# EAGLE design breakboard (EAGLE 7.2.0)
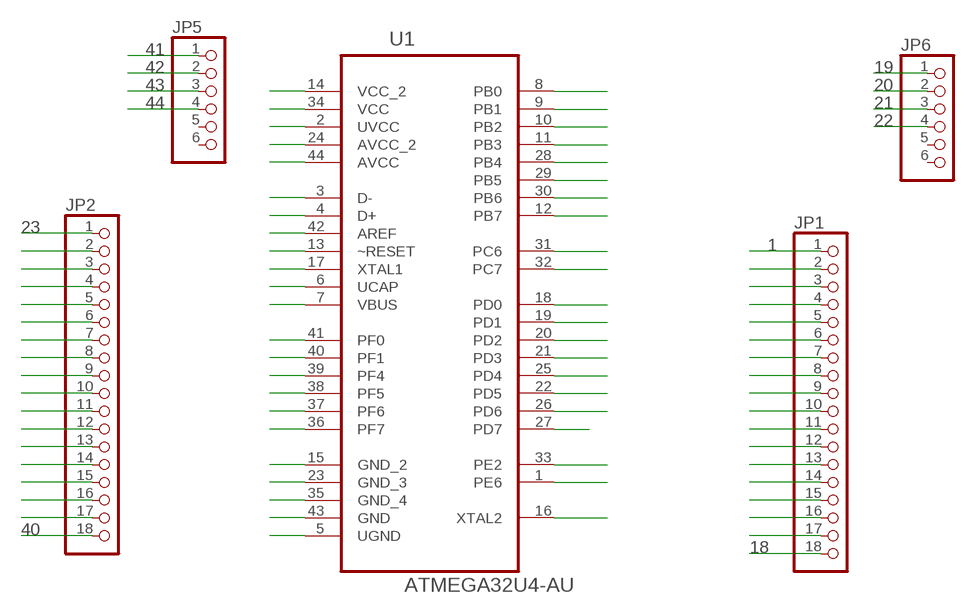
[diagram p0: schematic, sheet 1]

## Parts
JP1  PINHD-1X18-BIG  [1X18-BIG]
JP2  PINHD-1X18-BIG  [1X18-BIG]
JP5  PINHD-1X6  [1X06]
JP6  PINHD-1X6  [1X06]
U1  ATMEGA32U4-AU  [QFP80P1200X1200X120-44N]

## Nets
1: JP1.1 U1.1(PE6)
2: JP1.2 U1.2(UVCC)
3: JP1.3 U1.3(D-)
4: JP1.4 U1.4(D+)
5: JP1.5 U1.5(UGND)
6: JP1.6 U1.6(UCAP)
7: JP1.7 U1.7(VBUS)
8: JP1.8 U1.8(PB0)
9: JP1.9 U1.9(PB1)
10: JP1.10 U1.10(PB2)
11: JP1.11 U1.11(PB3)
12: JP1.12 U1.12(PB7)
13: JP1.13 U1.13(~RESET)
14: JP1.14 U1.14(VCC_2)
15: JP1.15 U1.15(GND_2)
16: JP1.16 U1.16(XTAL2)
17: JP1.17 U1.17(XTAL1)
18: JP1.18 U1.18(PD0)
19: JP6.1 U1.19(PD1)
20: JP6.2 U1.20(PD2)
21: JP6.3 U1.21(PD3)
22: JP6.4 U1.22(PD5)
23: JP2.1 U1.23(GND_3)
24: JP2.2 U1.24(AVCC_2)
25: JP2.3 U1.25(PD4)
26: JP2.4 U1.26(PD6)
27: JP2.5 U1.27(PD7)
28: JP2.6 U1.28(PB4)
29: JP2.7 U1.29(PB5)
30: JP2.8 U1.30(PB6)
31: JP2.9 U1.31(PC6)
32: JP2.10 U1.32(PC7)
33: JP2.11 U1.33(PE2)
34: JP2.12 U1.34(VCC)
35: JP2.13 U1.35(GND_4)
36: JP2.14 U1.36(PF7)
37: JP2.15 U1.37(PF6)
38: JP2.16 U1.38(PF5)
39: JP2.17 U1.39(PF4)
40: JP2.18 U1.40(PF1)
41: JP5.1 U1.41(PF0)
42: JP5.2 U1.42(AREF)
43: JP5.3 U1.43(GND)
44: JP5.4 U1.44(AVCC)
Unconnected: JP5.5 JP5.6 JP6.5 JP6.6

## Library data of the parts
JP1 JP2 = adafruit:PINHD-1X18: PIN HEADER
JP5 JP6 = adafruit:PINHD-1X6: PIN HEADER
U1 = Atmel_By_element14_Batch_1-00:ATMEGA32U4-AU: 8-bit Microcontroller with ISP Flash and USB Controller; MPN: ATMEGA32U4-AU; OC_FARNELL: 1748525; OC_NEWARK: 26R5633; PACKAGE: TQFP-44; SUPPLIER: Atmel

## Board
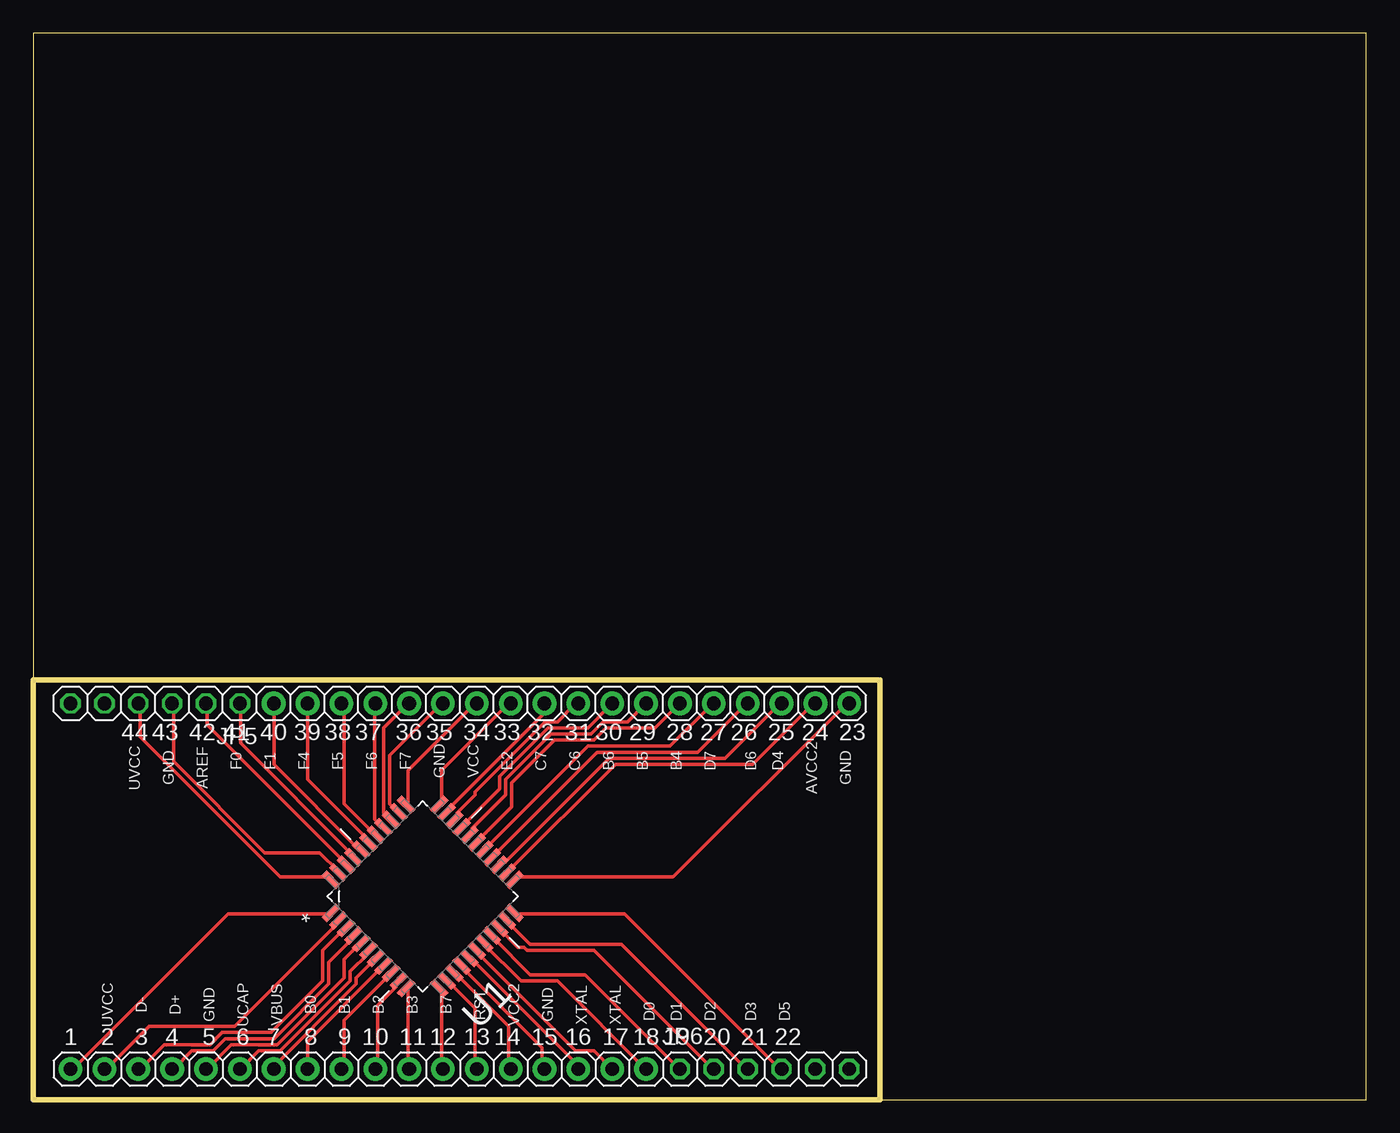
[diagram p1: board, top side]

Size 100 x 80 mm. Coordinates in mm from the lower left corner, seen from the top.
Outline: 63.5,0 100,0 100,80 0,80 0,31.5
Outline: 0,31.5 63.5,31.5 63.5,0
Outline: 63.5,0 0,0 0,31.5
Copper layers (1*16): Top 0.035mm / dielectric 1.5mm / Bottom 0.035mm
Design rules "default": minimum track width 10mil, minimum drill 24mil, track to track 8mil, track to pad 8mil, pad to pad 8mil, via to via 8mil, smd to smd 8mil, copper to edge 40mil, drill to drill 8mil, minimum pad ring 10mil, minimum via ring 8mil, stop-mask expansion 4mil, vias tented up to drill 0mil, thermal gap 10mil

### Footprints (pad centres in the part's own frame; a part is rotated, then mirrored left to right if it is on the bottom)
1X18-BIG = drill 1.016 pad 1.778: 1 -21.59,0; 2 -19.05,0; 3 -16.51,0; 4 -13.97,0; 5 -11.43,0; 6 -8.89,0; 7 -6.35,0; 8 -3.81,0; 9 -1.27,0; 10 1.27,0; 11 3.81,0; 12 6.35,0; 13 8.89,0; 14 11.43,0; 15 13.97,0; 16 16.51,0; 17 19.05,0; 18 21.59,0
1X06 = drill 1.016 octagon: 1 -6.35,0; 2 -3.81,0; 3 -1.27,0; 4 1.27,0; 5 3.81,0; 6 6.35,0
QFP80P1200X1200X120-44N = smd 1.473 x 0.508: 1 -5.74,3.988; 2 -5.74,3.2; 3 -5.74,2.388; 4 -5.74,1.6; 5 -5.74,0.787; 6 -5.74,0; 7 -5.74,-0.787; 8 -5.74,-1.6; 9 -5.74,-2.388; 10 -5.74,-3.2; 11 -5.74,-3.988; 23 5.74,-3.988; 24 5.74,-3.2; 25 5.74,-2.388; 26 5.74,-1.6; 27 5.74,-0.787; 28 5.74,0; 29 5.74,0.787; 30 5.74,1.6; 31 5.74,2.388; 32 5.74,3.2; 33 5.74,3.988 | smd 0.508 x 1.473: 12 -3.988,-5.74; 13 -3.2,-5.74; 14 -2.388,-5.74; 15 -1.6,-5.74; 16 -0.787,-5.74; 17 0,-5.74; 18 0.787,-5.74; 19 1.6,-5.74; 20 2.388,-5.74; 21 3.2,-5.74; 22 3.988,-5.74; 34 3.988,5.74; 35 3.2,5.74; 36 2.388,5.74; 37 1.6,5.74; 38 0.787,5.74; 39 0,5.74; 40 -0.787,5.74; 41 -1.6,5.74; 42 -2.388,5.74; 43 -3.2,5.74; 44 -3.988,5.74

### Placement (x,y rotation side)
JP1  24.38,2.29 0 top
JP2  39.62,29.72 180 top
JP5  9.14,29.72 180 top
JP6  54.86,2.29 0 top
U1  29.21,15.24 45 top

### Tracks (layer width: path | path; a pad name or v marks a point on that pad's centre or on a via)
1
  Top 0.254: U1.1 22.17,13.95 14.63,13.95 2.97,2.29 JP1.1
2
  Top 0.254: U1.2 22.86,13.26 15.09,5.49 8.69,5.49 5.49,2.29 JP1.2
3
  Top 0.254: U1.3 23.32,12.8 21.72,11.2 21.72,8.91 17.83,5.03 14.17,5.03 13.26,4.12 9.83,4.12 8,2.29 JP1.3
4
  Top 0.254: U1.4 24,12.12 22.17,10.29 22.17,8.69 18.06,4.57 14.4,4.57 13.49,3.66 11.89,3.66 10.52,2.29 JP1.4
5
  Top 0.254: U1.5 24.46,11.66 23.32,10.52 23.32,9.14 18.29,4.12 14.86,4.12 13.03,2.29 JP1.5
6
  Top 0.254: U1.6 25.15,10.97 23.77,9.6 23.77,8.91 18.52,3.66 16.92,3.66 15.54,2.29 JP1.6
7
  Top 0.254: U1.7 25.6,10.52 24.23,9.14 24.23,8.69 17.83,2.29 JP1.7
8
  Top 0.254: JP1.8 20.57,4.34 26.06,9.83 U1.8
9
  Top 0.254: U1.9 26.75,9.37 23.32,5.94 23.32,2.29 JP1.9
10
  Top 0.254: U1.10 27.2,8.91 27.2,8.46 25.83,7.09 25.83,2.29 JP1.10
11
  Top 0.254: U1.11 28.12,8.23 28.12,2.29 JP1.11
12
  Top 0.254: U1.12 30.63,8.23 30.63,2.29 JP1.12
13
  Top 0.254: U1.13 31.09,8.91 33.15,6.86 33.15,2.29 JP1.13
14
  Top 0.254: U1.14 31.77,9.37 35.66,5.49 35.66,2.29 JP1.14
15
  Top 0.254: U1.15 32.23,9.83 38.18,3.89 38.18,2.29 JP1.15
16
  Top 0.254: U1.16 32.92,10.52 40.69,2.74 40.69,2.29 JP1.16
17
  Top 0.254: JP1.17 42.06,3.66 40.69,3.66 33.38,10.97 U1.17
18
  Top 0.254: U1.18 33.83,11.66 36.58,8.91 39.32,8.91 45.95,2.29 JP1.18
19
  Top 0.254: U1.19 34.52,12.12 37.26,9.37 41.38,9.37 48.46,2.29 JP6.1
20
  Top 0.254: U1.20 34.98,12.8 36.35,11.43 36.8,11.43 37.03,11.2 42.06,11.2 50.98,2.29 JP6.2
21
  Top 0.254: U1.21 35.66,13.26 37.26,11.66 44.12,11.66 53.49,2.29 JP6.3
22
  Top 0.254: U1.22 36.12,13.95 44.35,13.95 56.01,2.29 JP6.4
23
  Top 0.254: U1.23 36.12,16.69 48.01,16.69 61.04,29.72 JP2.1
24
  Top 0.254: U1.24 35.66,17.14 43.66,25.15 53.95,25.15 58.52,29.72 JP2.2
25
  Top 0.254: U1.25 34.98,17.83 35.43,17.83 43.2,25.6 51.89,25.6 56.01,29.72 JP2.3
26
  Top 0.254: U1.26 34.52,18.29 42.29,26.06 49.84,26.06 53.49,29.72 JP2.4
27
  Top 0.254: U1.27 41.6,26.52 47.78,26.52 50.98,29.72 JP2.5
28
  Top 0.254: U1.28 33.38,19.43 35.89,21.95 35.89,23.77 39.09,26.98 42.06,26.98 42.98,27.89 46.63,27.89 48.46,29.72 JP2.6
29
  Top 0.254: U1.29 32.92,19.89 32.92,20.34 35.43,22.86 35.43,24 38.86,27.43 41.83,27.43 42.75,28.35 44.58,28.35 45.95,29.72 JP2.7
30
  Top 0.254: JP2.8 41.6,27.89 38.63,27.89 34.98,24.23 34.98,23.32 32.23,20.57 U1.30
31
  Top 0.254: U1.31 31.77,21.03 31.77,21.49 33.15,22.86 33.15,23.09 38.41,28.35 39.32,28.35 40.69,29.72 JP2.9
32
  Top 0.254: U1.32 31.09,21.72 38.18,28.8 38.18,29.72 JP2.10
33
  Top 0.254: U1.33 30.63,22.17 30.63,24.69 35.66,29.72 JP2.11
34
  Top 0.254: U1.34 28.12,22.17 28.12,24.69 33.15,29.72 JP2.12
35
  Top 0.254: U1.35 27.2,21.72 26.75,22.17 26.75,25.83 30.63,29.72 JP2.13
36
  Top 0.254: U1.36 26.75,21.03 26.29,21.49 26.29,27.89 28.12,29.72 JP2.14
37
  Top 0.254: U1.37 26.06,20.57 25.6,21.03 25.6,29.72 JP2.15
38
  Top 0.254: U1.38 25.6,19.89 23.32,22.17 23.32,29.72 JP2.16
39
  Top 0.254: JP2.17 20.57,24 25.15,19.43 U1.39
40
  Top 0.254: U1.40 24.46,18.75 18.06,25.15 18.06,29.72 JP2.18
41
  Top 0.254: U1.41 24,18.29 15.54,26.75 15.54,29.72 JP5.1
42
  Top 0.254: U1.42 23.32,17.83 13.03,28.12 13.03,29.72 JP5.2
43
  Top 0.254: U1.43 22.86,17.14 21.49,18.52 17.37,18.52 10.52,25.38 10.52,29.72 JP5.3
44
  Top 0.254: U1.44 22.17,16.69 18.52,16.69 8,27.2 8,29.72 JP5.4

### Text on the board
_tsilk: 44 | 43 | 42 | 41 | 40 | 39 | 38 | 37 | 36 | 35 | 34 | 33 | 32 | 31 | 30 | 29 | 28 | 27 | 26 | 25 | 24 | 23 | UVCC | GND | AREF | F0 | F1 | F4 | F5 | F6 | F7 | GND | VCC | E2 | C7 | C6 | B6 | B5 | B4 | D7 | D6 | D4 | AVCC2 | GND | UVCC | D- | D+ | GND | UCAP | VBUS | B0 | B1 | B2 | B3 | B7 | RST | VCC2 | GND | XTAL | XTAL | D0 | D1 | D2 | D3 | D5 | 1 | 2 | 3 | 4 | 5 | 6 | 7 | 8 | 9 | 10 | 11 | 12 | 13 | 14 | 15 | 16 | 17 | 18 | 19 | 20 | 21 | 22